# Altium project control_site.PrjPcb
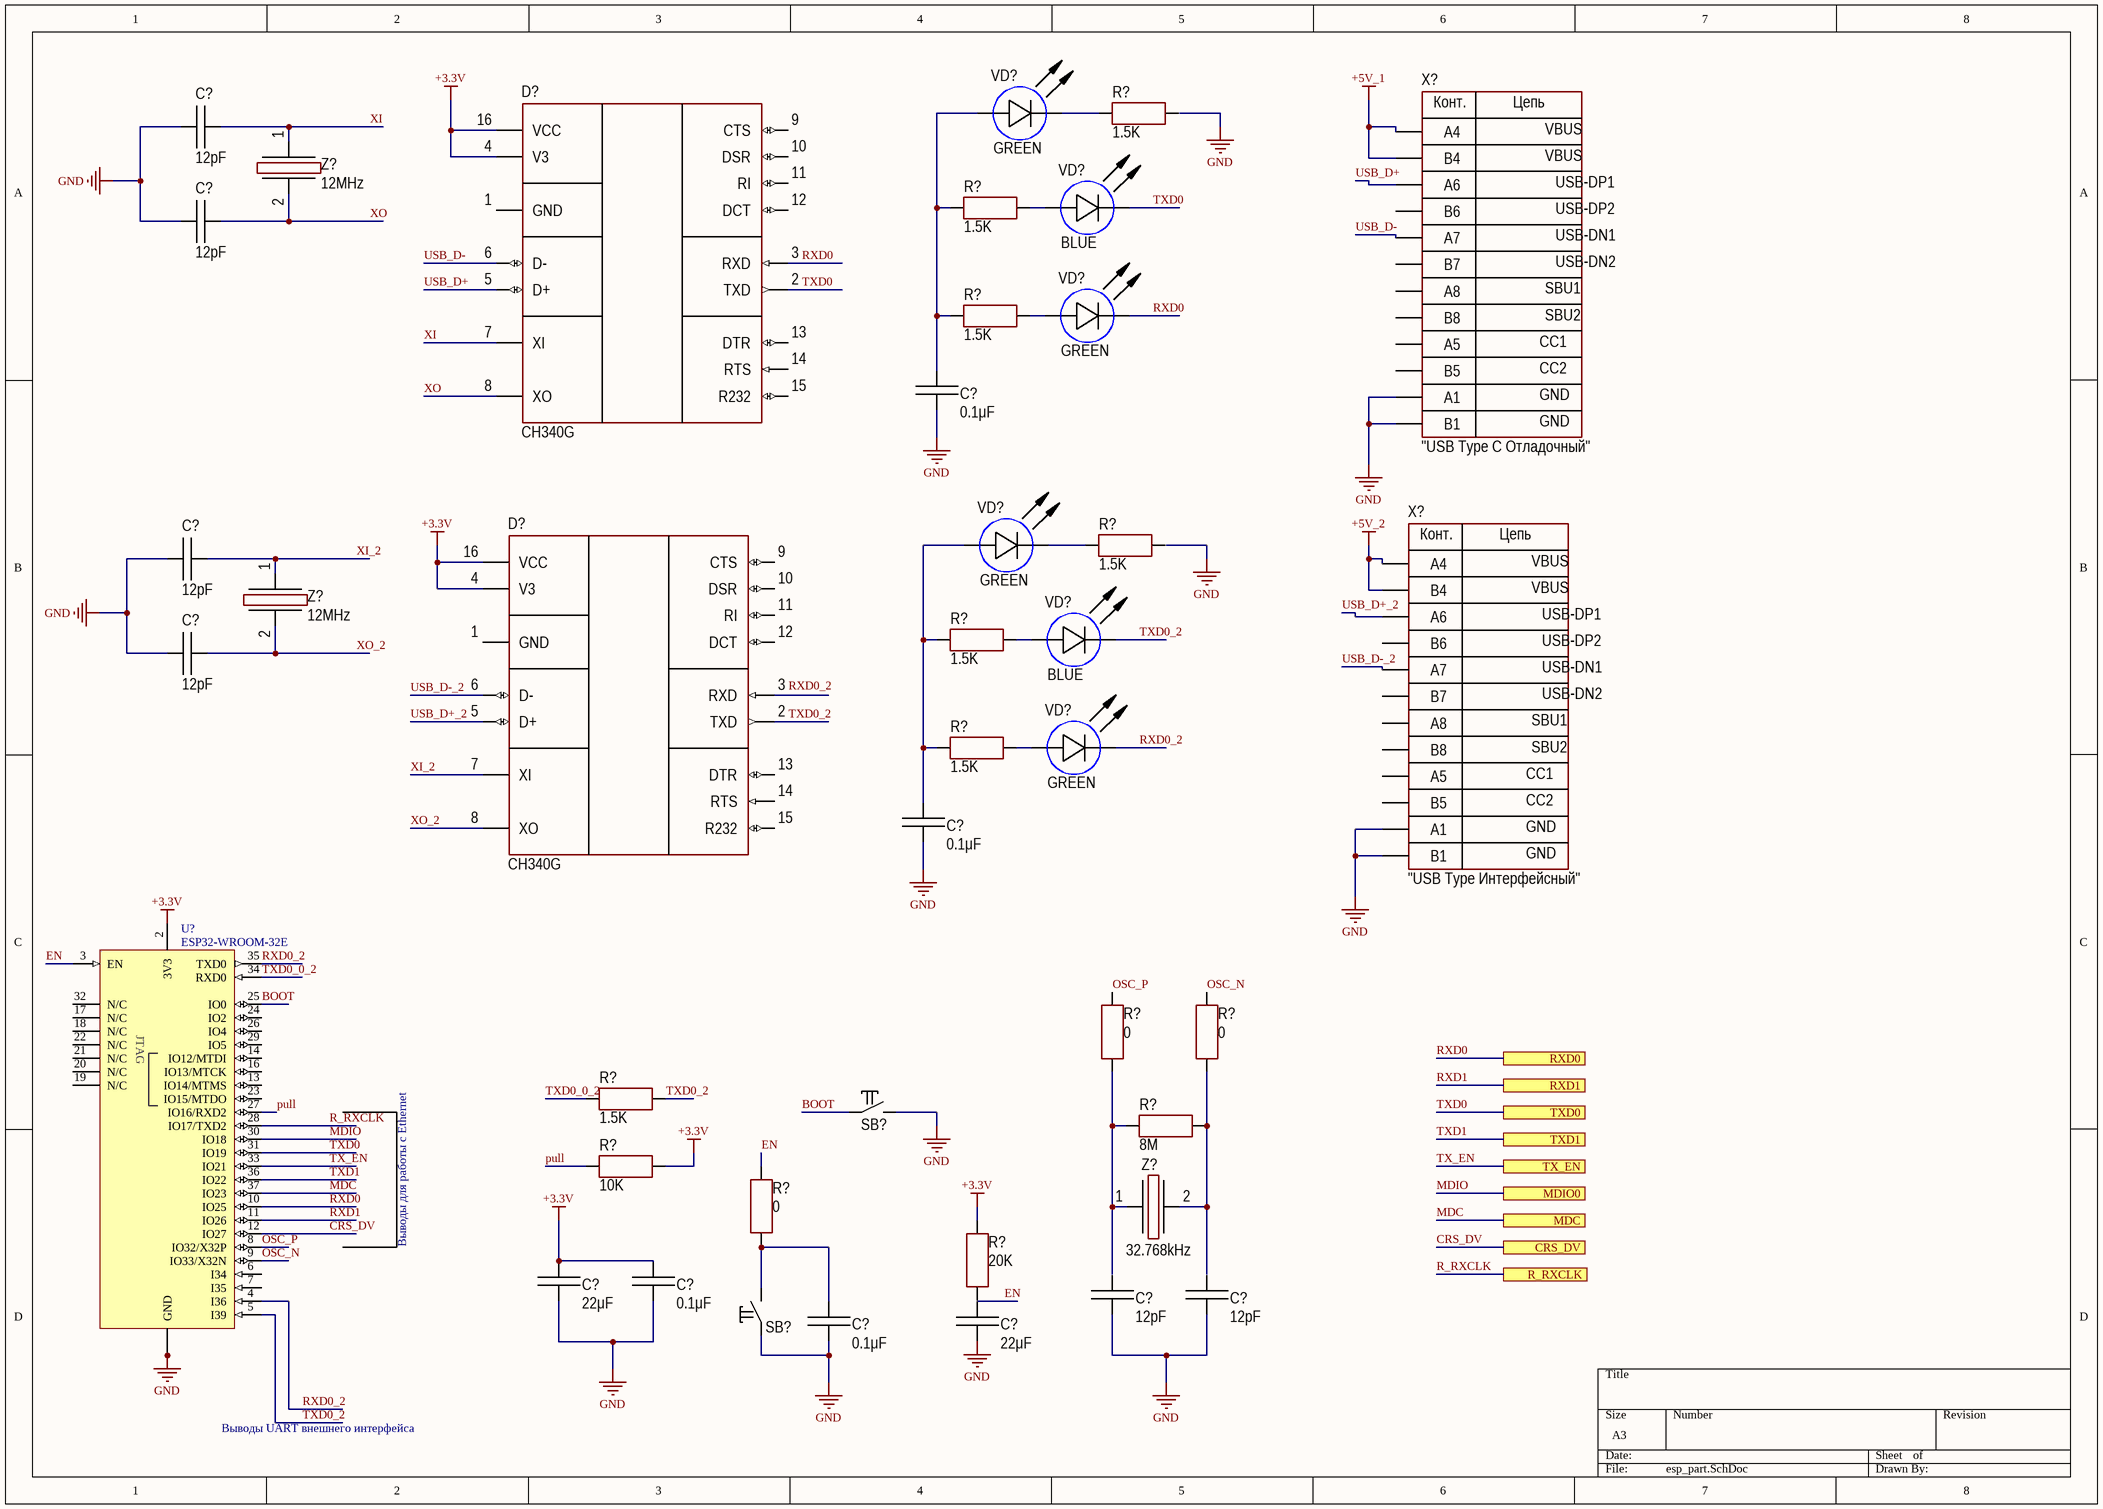
[diagram p0: esp_part.SchDoc]
3 sheets, 102 parts. Net scope: flat (ports and power ports of the same name join across sheets).
Sheets:
  esp_part.SchDoc
  Ethernet_part.SchDoc
  Power_part.SchDoc

## Sheet esp_part.SchDoc
size A3; SheetNumber: 1; SheetTotal: 3; SPICEModelCacheOSMDEVOJ: <root> / <DocumentId>OSMDEVOJ</DocumentId> / </root>

### Parts
(Parts that share a designator on the sheet are numbered #1, #2 ... from top to bottom, then left to right.)
C?#1  value 12pF  [CAP: 0603]
C?#2  value 12pF  [CAP: 0603]
C?#3  value 0.1μF  [CAP: 0603]
C?#4  value 12pF  [CAP: 0603]
C?#5  value 12pF  [CAP: 0603]
C?#6  value 0.1μF  [CAP: 0603]
C?#7  value 22μF  [CAP: 0603]
C?#8  value 0.1μF  [CAP: 0603]
C?#9  value 12pF  [CAP: 0603]
C?#10  value 12pF  [CAP: 0603]
C?#11  value 0.1μF  [CAP: 0603]
C?#12  value 22μF  [CAP: 0603]
D?#1  (no value)  [16-SOP]
D?#2  (no value)  [16-SOP]
R?#1  value 1.5K  [RES: 0603]
R?#2  value 1.5K  [RES: 0603]
R?#3  value 1.5K  [RES: 0603]
R?#4  value 1.5K  [RES: 0603]
R?#5  value 1.5K  [RES: 0603]
R?#6  value 1.5K  [RES: 0603]
R?#7  value 0  [RES: 0603]
R?#8  value 0  [RES: 0603]
R?#9  value 1.5K  [RES: 0603]
R?#10  value 8M  [RES: 0603]
R?#11  value 10K  [RES: 0603]
R?#12  value 0  [RES: 0603]
R?#13  value 20K  [RES: 0603]
SB?#1  (no value)  [BUT: 6x3.5 TH]
SB?#2  (no value)  [BUT: 6x3.5 TH]
U?#1  ESP32-WROOM-32E  [ESP32-WROOM-32E]
VD?#1  Color: GREEN  [LED: 0402B]
VD?#2  Color: BLUE  [LED: 0402B]
VD?#3  Color: GREEN  [LED: 0402B]
VD?#4  Color: GREEN  [LED: 0402B]
VD?#5  Color: BLUE  [LED: 0402B]
VD?#6  Color: GREEN  [LED: 0402B]
X?#1  CommentText: "USB Type C Отладочный"  [CON: TYPE-C-31-M-12]
X?#2  CommentText: "USB Type Интерфейсный"  [CON: TYPE-C-31-M-12]
Z?#1  Frequency: 12MHz  [OSC: 3215]
Z?#2  Frequency: 12MHz  [OSC: 3215]
Z?#3  Frequency: 32.768kHz  [OSC: 3215]

### Ports
CRS_DV (see Ethernet_part[4B]), MDC (see Ethernet_part[4B]), MDIO0 (see Ethernet_part[4A]), R_RXCLK (see Ethernet_part[4B]), RXD0 (see Ethernet_part[4A]), RXD1 (see Ethernet_part[4A]), TX_EN (see Ethernet_part[4A]), TXD0 (see Ethernet_part[4A]), TXD1 (see Ethernet_part[4A])

### Nets
+3.3V: C?#7.2 C?#8.2 D?#1.4(V3) D?#1.16(VCC) D?#2.4(V3) D?#2.16(VCC) R?#11.1 R?#13.2 U?#1.2(3V3)  [project net RXER]
+5V_1: X?#1.A4 X?#1.B4
+5V_2: X?#2.A4 X?#2.B4
GND: C?#1.1 C?#2.1 C?#3.1 C?#4.1 C?#5.1 C?#6.1 C?#7.1 C?#8.1 C?#9.1 C?#10.1 C?#11.2 C?#12.2 SB?#1.2 SB?#2.1 U?#1.1(GND) U?#1.15(GND) U?#1.38(GND) U?#1.39(GND) X?#1.A1 X?#1.B1 X?#2.A1 X?#2.B1
BOOT: SB?#1.1 U?#1.25(IO0)
CRS_DV: U?#1.12(IO27) ; port CRS_DV
EN: C?#12.1 R?#12.2 U?#1.3(EN)
MDC: U?#1.37(IO23) ; port MDC
MDIO: U?#1.30(IO18) ; port MDIO0
OSC_N: R?#8.1 U?#1.9(IO33/X32N)
OSC_P: R?#7.1 U?#1.8(IO32/X32P)
pull: R?#11.2 U?#1.27(IO16/RXD2)
R_RXCLK: U?#1.28(IO17/TXD2) ; port R_RXCLK
RXD0: D?#1.3(RXD) U?#1.10(IO25) VD?#3.2(C) ; port RXD0
RXD0_2: U?#1.4(I36) U?#1.35(TXD0) VD?#6.2(C)
RXD1: U?#1.11(IO26) ; port RXD1
TX_EN: U?#1.33(IO21) ; port TX_EN
TXD0: D?#1.2(TXD) U?#1.31(IO19) VD?#2.2(C) ; port TXD0
TXD0_0_2: R?#9.2 U?#1.34(RXD0)
TXD0_2: D?#2.2(TXD) R?#9.1 U?#1.5(I39) VD?#5.2(C)
TXD1: U?#1.36(IO22) ; port TXD1
USB_D+: D?#1.5(D+) X?#1.A6
USB_D+_2: D?#2.5(D+) X?#2.A6
USB_D-: D?#1.6(D-) X?#1.A7
USB_D-_2: D?#2.6(D-) X?#2.A7
XI: D?#1.7(XI) Z?#1.1
XI_2: D?#2.7(XI) Z?#2.1
XO: D?#1.8(XO) Z?#1.2
XO_2: D?#2.8(XO) Z?#2.2
NetC?#3_2: C?#3.2 R?#2.2 R?#3.2 VD?#1.1(A)
NetC?#6_2: C?#6.2 R?#5.2 R?#6.2 VD?#4.1(A)
NetC?#11_1: C?#11.1 R?#12.1 SB?#2.2
NetR?#1_2: R?#1.2 VD?#1.2(C)
NetR?#2_1: R?#2.1 VD?#2.1(A)
NetR?#3_1: R?#3.1 VD?#3.1(A)
NetR?#4_2: R?#4.2 VD?#4.2(C)
NetR?#5_1: R?#5.1 VD?#5.1(A)
NetR?#6_1: R?#6.1 VD?#6.1(A)
NetR?#7_2: R?#7.2 R?#10.2 Z?#3.1
NetR?#8_2: R?#8.2 R?#10.1 Z?#3.2

Not connected (* = marked no-connect by the designer): C?#1 2; C?#2 2; C?#4 2; C?#5 2; C?#9 2; C?#10 2; D?#1 1(GND) 9(CTS) 10(DSR) 11(RI) 12(DCT) 13(DTR) 14(RTS) 15(R232); D?#2 1(GND) 3(RXD) 9(CTS) 10(DSR) 11(RI) 12(DCT) 13(DTR) 14(RTS) 15(R232); R?#1 1; R?#4 1; R?#13 1; U?#1 6(I34) 7(I35) 13(IO14/MTMS) 14(IO12/MTDI) 16(IO13/MTCK) 17(N/C) 18(N/C) 19(N/C) 20(N/C) 21(N/C) 22(N/C) 23(IO15/MTDO) 24(IO2) 26(IO4) 29(IO5) 32(N/C); X?#1 A5 A8 B5 B6 B7 B8; X?#2 A5 A8 B5 B6 B7 B8

### Notes on the sheet
- Выводы для работы с Ethernet
- Выводы UART внешнего интерфейса
- Labels drawn without touching a wire or pin: RXD0_2
- (in symbol Connector_USB_Type_C) Конт.; Цепь; VBUS; USB-DP1; USB-DP2; USB-DN1; USB-DN2; SBU1; SBU2; CC1; CC2; GND
- (in symbol ESP32-WROOM-32E) JTAG

### Library data of the parts
C?#1 C?#2 C?#4 C?#5 C?#9 C?#10 = Ceramic_0603: Manufacturer: Yageo; PartNumber: CC0603KRX7R7BB104; ValueManufacturerPartNumber: Ceramic capacitor, 12pF, X7R, ±10%, 16V, 0603, -55...+125°C; TypeCapacitor: Ceramic capacitor; Tolerance: ±10%; TypeDielectric: X7R; Voltage: 16V; Package: 0603; HelpURL: https://www.digikey.com/product-detail/en/yageo/CC0603KRX7R7BB104/311-1088-1-ND/302998; Temperature: -55...+125°C
C?#3 C?#6 C?#8 C?#11 = Ceramic_0603: Manufacturer: Yageo; PartNumber: CC0603KRX7R7BB104; ValueManufacturerPartNumber: Ceramic capacitor, 0.1μF, X7R, ±10%, 16V, 0603, -55...+125°C; TypeCapacitor: Ceramic capacitor; Tolerance: ±10%; TypeDielectric: X7R; Voltage: 16V; Package: 0603; HelpURL: https://www.digikey.com/product-detail/en/yageo/CC0603KRX7R7BB104/311-1088-1-ND/302998; Temperature: -55...+125°C
C?#7 C?#12 = Ceramic_0603: Manufacturer: Yageo; PartNumber: CC0603KRX7R7BB104; ValueManufacturerPartNumber: Ceramic capacitor, 22μF, X7R, ±10%, 16V, 0603, -55...+125°C; TypeCapacitor: Ceramic capacitor; Tolerance: ±10%; TypeDielectric: X7R; Voltage: 16V; Package: 0603; HelpURL: https://www.digikey.com/product-detail/en/yageo/CC0603KRX7R7BB104/311-1088-1-ND/302998; Temperature: -55...+125°C
D?#1 D?#2 = CH340G: USB-to-UART; Manufacturer: WCH(Jiangsu Qin Heng); ValueManufacturerPartNumber: IC usb-to-uart bridge, USB2.0, 3...3.6V, -40...+85°C, 16- SOP; Supply: 3...3.6V; HelpURL: https://lcsc.com/product-detail/USB-ICs_WCH-Jiangsu-Qin-Heng-CH340G_C14267.html; Package: 16- SOP; ComponentType: IC usb-to-uart bridge; Temperature: -40...+85°C; Standard: USB2.0; PartNumber: CH340G
R?#1-R?#6 R?#9 = Resistor_0603: Manufacturer: Yageo; PartNumber: RC0603JR-07100RL; ValueManufacturerPartNumber: Resistor film, 1.5K, ±5%, 0603, 0.1W, -55...+125°C; TypeResistor: Resistor film; Power: 0.1W; Tolerance: ±5%; Package: 0603; HelpURL: https://www.digikey.com/product-detail/en/yageo/RC0603JR-07100RL/311-100GRCT-ND/729644; Temperature: -55...+125°C
R?#7 R?#8 R?#12 = Resistor_0603: Manufacturer: Yageo; PartNumber: RC0603JR-07100RL; ValueManufacturerPartNumber: Resistor film, 0, ±5%, 0603, 0.1W, -55...+125°C; TypeResistor: Resistor film; Power: 0.1W; Tolerance: ±5%; Package: 0603; HelpURL: https://www.digikey.com/product-detail/en/yageo/RC0603JR-07100RL/311-100GRCT-ND/729644; Temperature: -55...+125°C
R?#10 = Resistor_0603: Manufacturer: Yageo; PartNumber: RC0603JR-07100RL; ValueManufacturerPartNumber: Resistor film, 8M, ±5%, 0603, 0.1W, -55...+125°C; TypeResistor: Resistor film; Power: 0.1W; Tolerance: ±5%; Package: 0603; HelpURL: https://www.digikey.com/product-detail/en/yageo/RC0603JR-07100RL/311-100GRCT-ND/729644; Temperature: -55...+125°C
R?#11 = Resistor_0603: Manufacturer: Yageo; PartNumber: RC0603JR-07100RL; ValueManufacturerPartNumber: Resistor film, 10K, ±5%, 0603, 0.1W, -55...+125°C; TypeResistor: Resistor film; Power: 0.1W; Tolerance: ±5%; Package: 0603; HelpURL: https://www.digikey.com/product-detail/en/yageo/RC0603JR-07100RL/311-100GRCT-ND/729644; Temperature: -55...+125°C
R?#13 = Resistor_0603: Manufacturer: Yageo; PartNumber: RC0603JR-07100RL; ValueManufacturerPartNumber: Resistor film, 20K, ±5%, 0603, 0.1W, -55...+125°C; TypeResistor: Resistor film; Power: 0.1W; Tolerance: ±5%; Package: 0603; HelpURL: https://www.digikey.com/product-detail/en/yageo/RC0603JR-07100RL/311-100GRCT-ND/729644; Temperature: -55...+125°C
SB?#1 SB?#2 = Button_tactile: Manufacturer: TE Connectivity; ValueManufacturerPartNumber: Tactile button, 6x6mm; PartNumber: FSM2JSMAATR; TypeButton: Tactile button; CommentText: "Кнопка"; HelpURL: https://www.digikey.com/product-detail/en/te-connectivity-alcoswitch-switches/FSM2JSMAATR/450-1792-1-ND/3503931; Package: 6x6mm
U?#1 = ESP32-WROOM-32E: PCB Antenna - 4,8,16 MB Flash - WiFi - BT - MCU; Manufacturer_Name: Espressif Systems; ComponentLink1Description: Datasheet; ComponentLink1URL: https://www.espressif.com/sites/default/files/documentation/esp32-wroom-32e_esp32-wroom-32ue_datasheet_en.pdf; ComponentLink2Description: SoC Datasheet; ComponentLink2URL: https://www.espressif.com/sites/default/files/documentation/esp32_datasheet_en.pdf; ComponentLink3Description: Devkit; ComponentLink3URL: https://www.espressif.com/en/products/devkits/esp32-devkitc
VD?#1 VD?#3 VD?#4 VD?#6 = LED_single: ValueManufacturerPartNumber: LED, Green, *, *, *, -55...+150°C; TypeDiode: LED; Manufacturer: *; Package: *; HelpURL: *; Temperature: -55...+150°C; Current: *; VoltageDrop: *; PartNumber: *; ColorParameter: Green
VD?#2 VD?#5 = LED_single: ValueManufacturerPartNumber: LED, Green, *, *, *, -55...+150°C; TypeDiode: LED; ColorParameter: Green; Manufacturer: *; Package: *; HelpURL: *; Temperature: -55...+150°C; Current: *; VoltageDrop: *; PartNumber: *
X?#1 X?#2 = Connector_USB_Type_C: Manufacturer: Korean Hroparts; ValueManufacturerPartNumber: USB Type C, 3A; PartNumber: TYPE-C-31-M-12; TypeConnector: USB Type C; CurrentMax: 3A; HelpURL: https://lcsc.com/product-detail/USB-Type-C_Korean-Hroparts-Elec-TYPE-C-31-M-12_C165948.html
Z?#1 Z?#2 = Crystal_3215: Manufacturer: Epson; PartNumber: FC-135 32.7680KA-A5; ValueManufacturerPartNumber: Crystal, 12MHz, 12.5pF, ±20ppm, case 3215, -40...+85°C; LoadCapacitance: 12.5pF; Tolerance: ±20ppm; Package: case 3215; HelpURL: https://www.digikey.com/product-detail/en/epson/FC-135-32.7680KA-A5/SER4103CT-ND/6188447; Temperature: -40...+85°C; TypeOscilator: Crystal
Z?#3 = Crystal_3215: Manufacturer: Epson; PartNumber: FC-135 32.7680KA-A5; ValueManufacturerPartNumber: Crystal, 32.768kHz, 12.5pF, ±20ppm, case 3215, -40...+85°C; LoadCapacitance: 12.5pF; Tolerance: ±20ppm; Package: case 3215; HelpURL: https://www.digikey.com/product-detail/en/epson/FC-135-32.7680KA-A5/SER4103CT-ND/6188447; Temperature: -40...+85°C; TypeOscilator: Crystal

## Sheet Ethernet_part.SchDoc
size A4; SheetNumber: 2; SheetTotal: 3
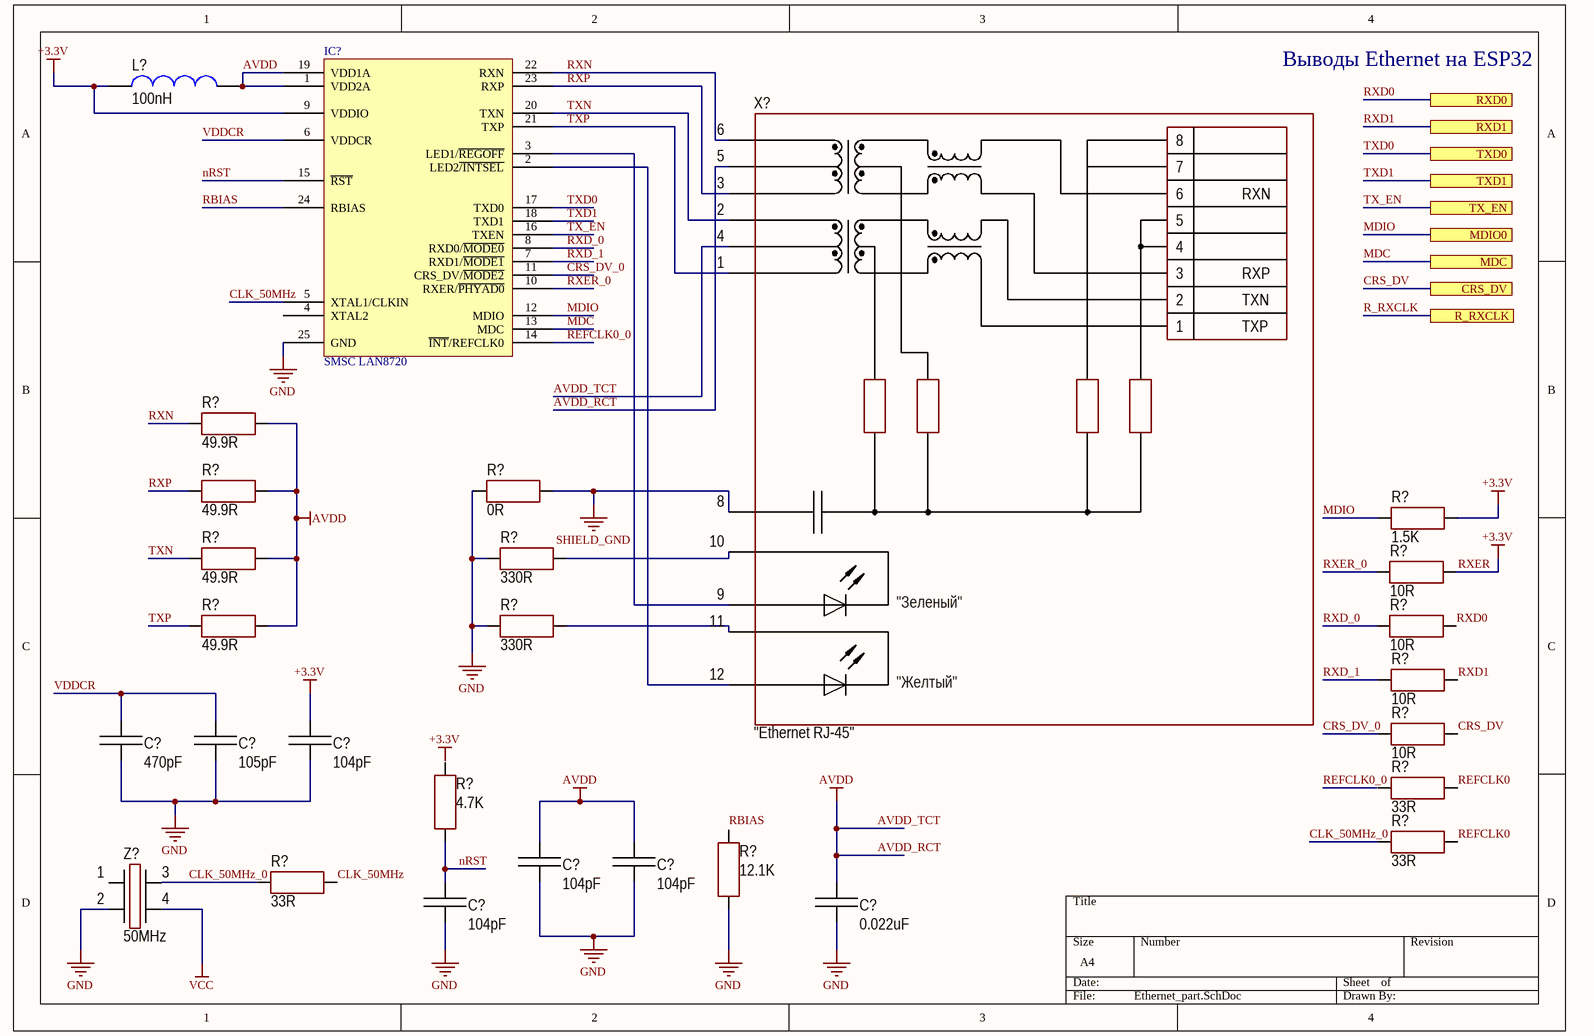
[diagram p1: Ethernet_part.SchDoc]

### Parts
(Parts that share a designator on the sheet are numbered #1, #2 ... from top to bottom, then left to right.)
C?#13  value 470pF  [CAP: 0402]
C?#14  value 105pF  [CAP: 0402]
C?#15  value 104pF  [CAP: 0402]
C?#16  value 104pF  [CAP: 0402]
C?#17  value 104pF  [CAP: 0402]
C?#18  value 104pF  [CAP: 0402]
C?#19  value 0.022uF  [CAP: 0402]
IC?  SMSC LAN8720  [MICROCHIP QFN-24 4x4]
L?  value 100nH  [IND: 0402]
R?#14  value 49.9R  [RES: 0402]
R?#15  value 49.9R  [RES: 0402]
R?#16  value 0R  [RES: 0402]
R?#17  value 1.5K  [RES: 0402]
R?#18  value 49.9R  [RES: 0402]
R?#19  value 330R  [RES: 0402]
R?#20  value 10R  [RES: 0402]
R?#21  value 49.9R  [RES: 0402]
R?#22  value 330R  [RES: 0402]
R?#23  value 10R  [RES: 0402]
R?#24  value 10R  [RES: 0402]
R?#25  value 10R  [RES: 0402]
R?#26  value 4.7K  [RES: 0402]
R?#27  value 33R  [RES: 0402]
R?#28  value 12.1K  [RES: 0402]
R?#29  value 33R  [RES: 0402]
R?#30  value 33R  [RES: 0402]
X?#3  CommentText: "Ethernet RJ-45"  [CON: HR911105A]
Z?#4  Frequency: 50MHz  [OSC: 3225]

### Ports
CRS_DV (see esp_part[6D]), MDC (see esp_part[6D]), MDIO0 (see esp_part[6D]), R_RXCLK (see esp_part[6D]), RXD0 (see esp_part[6C]), RXD1 (see esp_part[6C]), TX_EN (see esp_part[6D]), TXD0 (see esp_part[6C]), TXD1 (see esp_part[6D])

### Nets
AVDD: C?#16.2 C?#17.2 C?#19.2 IC?.1(VDD2A) IC?.19(VDD1A) L?.1 R?#14.1 R?#15.1 R?#18.1 R?#21.1 X?#3.4(CT) X?#3.5(CT)  [also labelled AVDD_RCT, AVDD_TCT]
GND: C?#15.1 C?#17.1 C?#19.1 IC?.25(GND) R?#16.1 R?#19.1 R?#22.1 R?#28.2 Z?#4.2
RXER: C?#15.2 IC?.9(VDDIO) L?.2 R?#17.1 R?#20.1  [also labelled +3.3V]
SHIELD_GND: R?#16.2 X?#3.8(GND)
VCC: Z?#4.4
CLK_50MHz: IC?.5(XTAL1/CLKIN) R?#30.2
CLK_50MHz_0: R?#29.2 R?#30.1 Z?#4.3
CRS_DV: R?#25.1 ; port CRS_DV
CRS_DV_0: IC?.11(CRS_DV/~{MODE2}) R?#25.2
MDC: IC?.13(MDC) ; port MDC
MDIO: IC?.12(MDIO) R?#17.2 ; port MDIO0
nRST: C?#18.2 IC?.15(~{RST}) R?#26.2
RBIAS: IC?.24(RBIAS)
REFCLK0: R?#27.1 R?#29.1
REFCLK0_0: IC?.14(~{INT}/REFCLK0)
RXD0: R?#23.1 ; port RXD0
RXD1: R?#24.1 ; port RXD1
RXD_0: IC?.8(RXD0/~{MODE0}) R?#23.2
RXD_1: IC?.7(RXD1/~{MODE1}) R?#24.2
RXER_0: IC?.10(RXER/~{PHYAD0}) R?#20.2
RXN: IC?.22(RXN) R?#14.2 X?#3.6(RD-)
RXP: IC?.23(RXP) R?#15.2 X?#3.3(RD+)
TX_EN: IC?.16(TXEN) ; port TX_EN
TXD0: IC?.17(TXD0) ; port TXD0
TXD1: IC?.18(TXD1) ; port TXD1
TXN: IC?.20(TXN) R?#18.2 X?#3.2(TD-)
TXP: IC?.21(TXP) R?#21.2 X?#3.1(TD+)
VDDCR: C?#13.2 C?#14.2 IC?.6(VDDCR)
NetIC?_2: IC?.2(LED2~{/INTSEL}) X?#3.12(D4)
NetIC?_3: IC?.3(LED1/~{REGOFF}) X?#3.9(D2)
NetR?#19_2: R?#19.2 X?#3.10(D1)
NetR?#22_2: R?#22.2 X?#3.11(D3)

Not connected (* = marked no-connect by the designer): C?#13 1; C?#14 1; C?#16 1; C?#18 1; IC? 4(XTAL2); R?#26 1; R?#27 2; R?#28 1; Z?#4 1

### Notes on the sheet
- Выводы Ethernet на ESP32
- Labels drawn without touching a wire or pin: +3.3V, RBIAS
- (in symbol Connector_HR911105A) 7; RXN; RXP; TXN; TXP; "Зеленый"; "Желтый"

### Library data of the parts
C?#13 = Ceramic_0402: Manufacturer: Yageo; PartNumber: CC0402KRX7R7BB104; ValueManufacturerPartNumber: Ceramic capacitor, 470pF, X7R, ±10%, 16V, 0402, -55...+125°C; TypeCapacitor: Ceramic capacitor; Tolerance: ±10%; TypeDielectric: X7R; Voltage: 16V; Package: 0402; HelpURL: https://www.digikey.com/product-detail/en/yageo/CC0402KRX7R7BB104/311-1338-1-ND/2103122; Temperature: -55...+125°C
C?#14 = Ceramic_0402: Manufacturer: Yageo; PartNumber: CC0402KRX7R7BB104; ValueManufacturerPartNumber: Ceramic capacitor, 105pF, X7R, ±10%, 16V, 0402, -55...+125°C; TypeCapacitor: Ceramic capacitor; Tolerance: ±10%; TypeDielectric: X7R; Voltage: 16V; Package: 0402; HelpURL: https://www.digikey.com/product-detail/en/yageo/CC0402KRX7R7BB104/311-1338-1-ND/2103122; Temperature: -55...+125°C
C?#15-C?#18 = Ceramic_0402: Manufacturer: Yageo; PartNumber: CC0402KRX7R7BB104; ValueManufacturerPartNumber: Ceramic capacitor, 104pF, X7R, ±10%, 16V, 0402, -55...+125°C; TypeCapacitor: Ceramic capacitor; Tolerance: ±10%; TypeDielectric: X7R; Voltage: 16V; Package: 0402; HelpURL: https://www.digikey.com/product-detail/en/yageo/CC0402KRX7R7BB104/311-1338-1-ND/2103122; Temperature: -55...+125°C
C?#19 = Ceramic_0402: Manufacturer: Yageo; PartNumber: CC0402KRX7R7BB104; ValueManufacturerPartNumber: Ceramic capacitor, 0.022uF, X7R, ±10%, 16V, 0402, -55...+125°C; TypeCapacitor: Ceramic capacitor; Tolerance: ±10%; TypeDielectric: X7R; Voltage: 16V; Package: 0402; HelpURL: https://www.digikey.com/product-detail/en/yageo/CC0402KRX7R7BB104/311-1338-1-ND/2103122; Temperature: -55...+125°C
IC? = SMSC LAN8720: Small Footprint RMII 10/100 Ethernet  Transceiver with HP Auto-MDIX Support
L? = Inductor_0402: Manufacturer: Murata Electronics; PartNumber: LQG15HSR10J02D; ValueManufacturerPartNumber: Fixed inductor, 100nH, ±5%, 0402, 200mA, -55...+125°C; TypeInductor: Fixed inductor; MaxCurrent: 200mA; Tolerance: ±5%; Package: 0402; HelpURL: https://www.digikey.com/product-detail/en/murata-electronics-north-america/LQG15HSR10J02D/490-2635-1-ND/662915; Temperature: -55...+125°C
R?#14 R?#15 R?#18 R?#21 = Resistor_0402: Manufacturer: Yageo; PartNumber: RC0402JR-07100RL; ValueManufacturerPartNumber: Resistor film, 49.9R, ±5%, 0402, 0.063W, -55...+125°C; TypeResistor: Resistor film; Power: 0.063W; Tolerance: ±5%; Package: 0402; HelpURL: https://www.digikey.com/product-detail/en/yageo/RC0402JR-07100RL/311-100JRCT-ND/729362; Temperature: -55...+125°C
R?#16 = Resistor_0402: Manufacturer: Yageo; PartNumber: RC0402JR-07100RL; ValueManufacturerPartNumber: Resistor film, 0R, ±5%, 0402, 0.063W, -55...+125°C; TypeResistor: Resistor film; Power: 0.063W; Tolerance: ±5%; Package: 0402; HelpURL: https://www.digikey.com/product-detail/en/yageo/RC0402JR-07100RL/311-100JRCT-ND/729362; Temperature: -55...+125°C
R?#17 = Resistor_0402: Manufacturer: Yageo; PartNumber: RC0402JR-07100RL; ValueManufacturerPartNumber: Resistor film, 1.5K, ±5%, 0402, 0.063W, -55...+125°C; TypeResistor: Resistor film; Power: 0.063W; Tolerance: ±5%; Package: 0402; HelpURL: https://www.digikey.com/product-detail/en/yageo/RC0402JR-07100RL/311-100JRCT-ND/729362; Temperature: -55...+125°C
R?#19 R?#22 = Resistor_0402: Manufacturer: Yageo; PartNumber: RC0402JR-07100RL; ValueManufacturerPartNumber: Resistor film, 330R, ±5%, 0402, 0.063W, -55...+125°C; TypeResistor: Resistor film; Power: 0.063W; Tolerance: ±5%; Package: 0402; HelpURL: https://www.digikey.com/product-detail/en/yageo/RC0402JR-07100RL/311-100JRCT-ND/729362; Temperature: -55...+125°C
R?#20 R?#23-R?#25 = Resistor_0402: Manufacturer: Yageo; PartNumber: RC0402JR-07100RL; ValueManufacturerPartNumber: Resistor film, 10R, ±5%, 0402, 0.063W, -55...+125°C; TypeResistor: Resistor film; Power: 0.063W; Tolerance: ±5%; Package: 0402; HelpURL: https://www.digikey.com/product-detail/en/yageo/RC0402JR-07100RL/311-100JRCT-ND/729362; Temperature: -55...+125°C
R?#26 = Resistor_0402: Manufacturer: Yageo; PartNumber: RC0402JR-07100RL; ValueManufacturerPartNumber: Resistor film, 4.7K, ±5%, 0402, 0.063W, -55...+125°C; TypeResistor: Resistor film; Power: 0.063W; Tolerance: ±5%; Package: 0402; HelpURL: https://www.digikey.com/product-detail/en/yageo/RC0402JR-07100RL/311-100JRCT-ND/729362; Temperature: -55...+125°C
R?#27 R?#29 R?#30 = Resistor_0402: Manufacturer: Yageo; PartNumber: RC0402JR-07100RL; ValueManufacturerPartNumber: Resistor film, 33R, ±5%, 0402, 0.063W, -55...+125°C; TypeResistor: Resistor film; Power: 0.063W; Tolerance: ±5%; Package: 0402; HelpURL: https://www.digikey.com/product-detail/en/yageo/RC0402JR-07100RL/311-100JRCT-ND/729362; Temperature: -55...+125°C
R?#28 = Resistor_0402: Manufacturer: Yageo; PartNumber: RC0402JR-07100RL; ValueManufacturerPartNumber: Resistor film, 12.1K, ±5%, 0402, 0.063W, -55...+125°C; TypeResistor: Resistor film; Power: 0.063W; Tolerance: ±5%; Package: 0402; HelpURL: https://www.digikey.com/product-detail/en/yageo/RC0402JR-07100RL/311-100JRCT-ND/729362; Temperature: -55...+125°C
X?#3 = Connector_HR911105A: Manufacturer: Hanrun; ValueManufacturerPartNumber: Etherner RJ-45 connector; HelpURL: https://ru.aliexpress.com/item/32244614847.html?spm=a2g0v.search0104.3.9.304d24e7qb4B5g&ws_ab_test=searchweb0_0%2Csearchweb201602_10_10065_10068_319_317_10696_453_10084_454_10083_10618_10307_10301_537_536_10059_10884_10887_321_322_10915_10103_10914_10911_10910%2Csearchweb201603_52%2CppcSwitch_0&algo_expid=ad591376-da58-472d-83c6-21bacd43ef2b-1&algo_pvid=ad591376-da58-472d-83c6-21bacd43ef2b&transAbTest=ae803_5; TypeConnector: Etherner RJ-45 connector; PartNumber: HR911105A
Z?#4 = Crystal_3225: Manufacturer: Diodes Incorporated; PartNumber: FL1000002; ValueManufacturerPartNumber: Crystal, 50MHz, 12pF, ±25ppm, case 3225, -40...+85°C; LoadCapacitance: 12pF; Tolerance: ±25ppm; Package: case 3225; HelpURL: https://www.digikey.com/product-detail/en/diodes-incorporated/FL1000002/FL1000002CT-ND/6042078; Temperature: -40...+85°C; TypeOscilator: Crystal

## Sheet Power_part.SchDoc
size A4; SheetNumber: 3; SheetTotal: 3
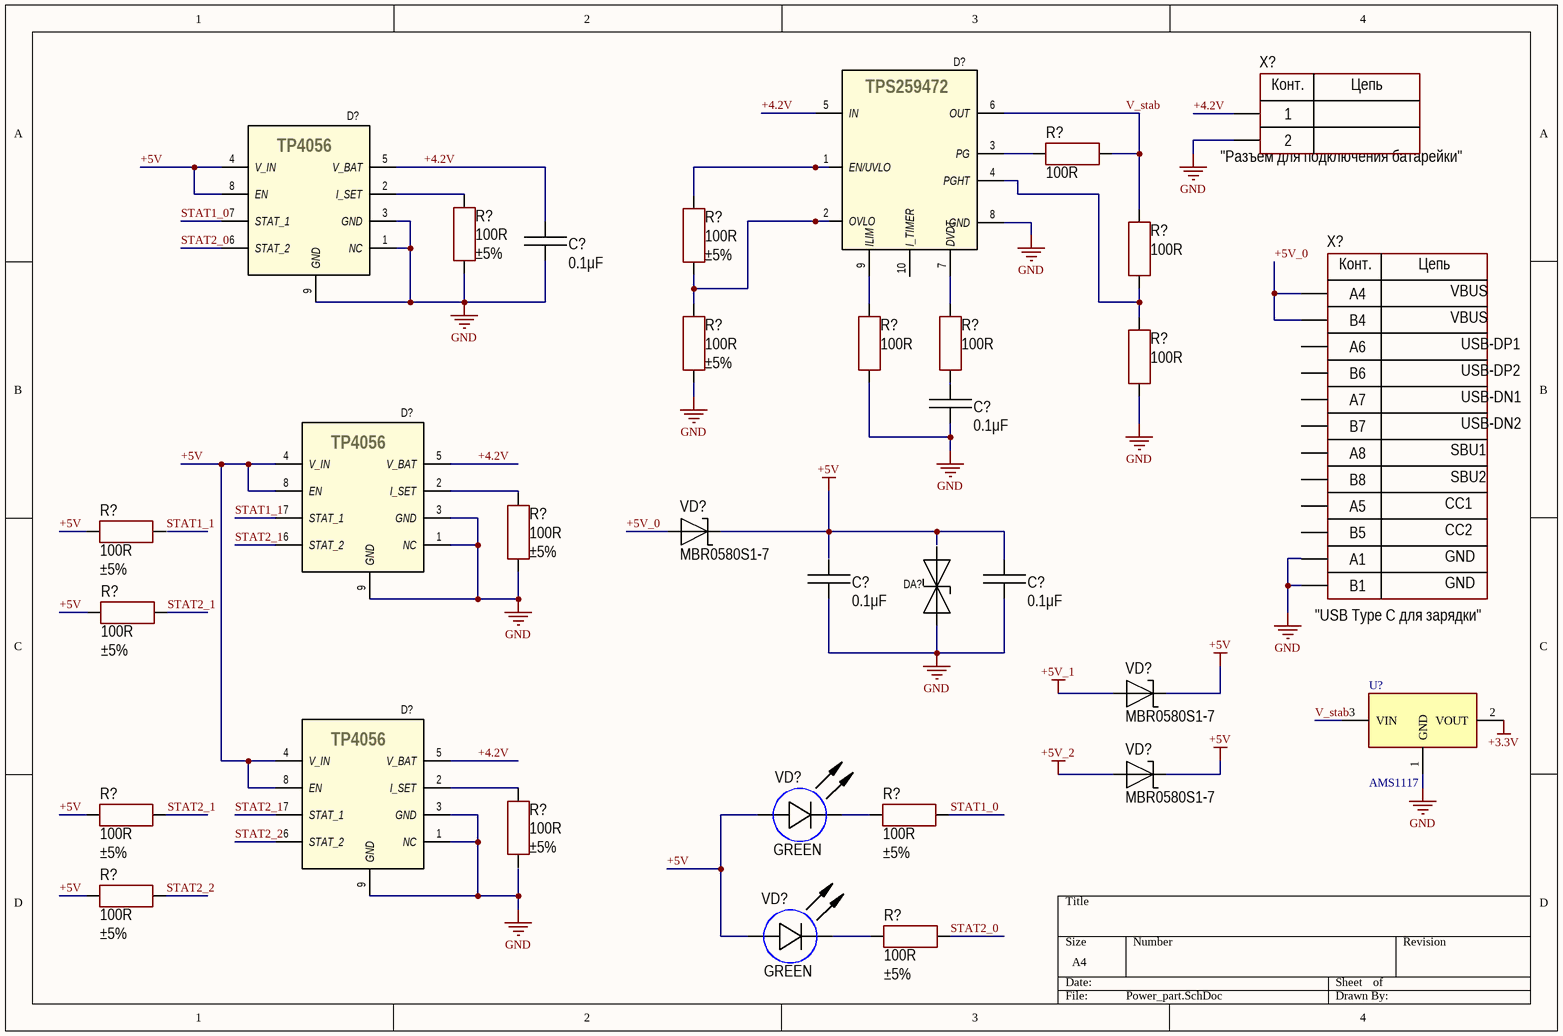
[diagram p2: Power_part.SchDoc]

### Parts
(Parts that share a designator on the sheet are numbered #1, #2 ... from top to bottom, then left to right.)
C?#20  value 0.1μF  [CAP: 0603]
C?#21  value 0.1μF  [CAP: 0603]
C?#22  value 0.1μF  [CAP: 0603]
C?#23  value 0.1μF  [CAP: 0603]
D?#3  Texas Instruments  [TPS259472ARPWR]  (value not drawn)
D?#4  UTD Semiconductor Co.,Ltd  [TP4056]  (value not drawn)
D?#5  UTD Semiconductor Co.,Ltd  [TP4056]  (value not drawn)
D?#6  UTD Semiconductor Co.,Ltd  [TP4056]  (value not drawn)
DA?  Littelfuse  [SMAJ12CA]  (value not drawn)
R?#31  value 100R  [RES: 0603]
R?#32  value 100R  Tolerance: ±5%  [RES: 0603]
R?#33  value 100R  Tolerance: ±5%  [RES: 0603]
R?#34  value 100R  [RES: 0603]
R?#35  value 100R  Tolerance: ±5%  [RES: 0603]
R?#36  value 100R  [RES: 0603]
R?#37  value 100R  [RES: 0603]
R?#38  value 100R  [RES: 0603]
R?#39  value 100R  Tolerance: ±5%  [RES: 0603]
R?#40  value 100R  Tolerance: ±5%  [RES: 0603]
R?#41  value 100R  Tolerance: ±5%  [RES: 0603]
R?#42  value 100R  Tolerance: ±5%  [RES: 0603]
R?#43  value 100R  Tolerance: ±5%  [RES: 0603]
R?#44  value 100R  Tolerance: ±5%  [RES: 0603]
R?#45  value 100R  Tolerance: ±5%  [RES: 0603]
R?#46  value 100R  Tolerance: ±5%  [RES: 0603]
U?#2  AMS1117  [AMS1117]
VD?#7  PartNumber: MBR0580S1-7  [DIODE: SMA]
VD?#8  PartNumber: MBR0580S1-7  [DIODE: SMA]
VD?#9  PartNumber: MBR0580S1-7  [DIODE: SMA]
VD?#10  Color: GREEN  [LED: 0402B]
VD?#11  Color: GREEN  [LED: 0402B]
X?#4  CommentText: "Разъем для подключения батарейки"  [CON: PLS-2]
X?#5  CommentText: "USB Type C для зарядки"  [CON: TYPE-C-31-M-12]

### Nets
+3.3V: U?#2.2(VOUT)  [project net RXER]
+5V: C?#23.2 D?#4.4(V_IN) D?#4.8(EN) D?#5.4(V_IN) D?#5.8(EN) D?#6.4(V_IN) D?#6.8(EN) R?#39.1 R?#41.1 R?#42.1 R?#45.2 VD?#7.2 VD?#8.2 VD?#9.2 VD?#10.1(A) VD?#11.1(A)
+5V_1: VD?#8.1
+5V_2: VD?#9.1
GND: C?#20.2 C?#21.1 C?#22.1 C?#23.1 D?#3.8(GND) D?#4.1(NC) D?#4.3(GND) D?#4.9(GND) D?#5.1(NC) D?#5.3(GND) D?#5.9(GND) D?#6.1(NC) D?#6.3(GND) D?#6.9(GND) DA?.2 R?#32.1 R?#35.1 R?#36.1 R?#38.1 R?#40.1 U?#2.1(GND) X?#4.2 X?#5.A1 X?#5.B1
+4.2V: C?#20.1 D?#3.5(IN) D?#4.5(V_BAT) D?#5.5(V_BAT) D?#6.5(V_BAT) X?#4.1
+5V_0: VD?#7.1 X?#5.A4 X?#5.B4
STAT1_0: D?#4.7(STAT_1) R?#43.2
STAT1_1: D?#5.7(STAT_1) R?#39.2
STAT2_0: D?#4.6(STAT_2) R?#46.2
STAT2_1: D?#5.6(STAT_2) D?#6.7(STAT_1) R?#41.2 R?#42.2
STAT2_2: D?#6.6(STAT_2) R?#45.1
V_stab: D?#3.6(OUT) R?#31.1 R?#34.2 U?#2.3(VIN)
NetC?#21_2: C?#21.2 R?#37.1
NetD?#3_1: D?#3.1(EN/UVLO) R?#33.2
NetD?#3_2: D?#3.2(OVLO) R?#33.1 R?#35.2
NetD?#3_3: D?#3.3(PG) R?#31.2
NetD?#3_4: D?#3.4(PGHT) R?#34.1 R?#38.2
NetD?#3_7: D?#3.7(DVDT) R?#37.2
NetD?#3_9: D?#3.9(ILIM) R?#36.2
NetD?#4_2: D?#4.2(I_SET) R?#32.2
NetD?#5_2: D?#5.2(I_SET) R?#40.2
NetD?#6_2: D?#6.2(I_SET) R?#44.2
NetR?#43_1: R?#43.1 VD?#10.2(C)
NetR?#46_1: R?#46.1 VD?#11.2(C)

Not connected (* = marked no-connect by the designer): C?#22 2; D?#3 10(I_TIMER); DA? 1; R?#44 1; X?#5 A5 A6 A7 A8 B5 B6 B7 B8

### Notes on the sheet
- (in symbol Connector_USB_Type_C) Конт.; Цепь; VBUS; USB-DP1; USB-DP2; USB-DN1; USB-DN2; SBU1; SBU2; CC1; CC2; GND
- (in symbol PLS-2) Конт.; Цепь
- (in symbol TPS259472ARPWR) TPS259472

### Library data of the parts
C?#20-C?#23 = Ceramic_0603: as C?#3 on sheet esp_part; Package: 0603; HelpURL: https://www.digikey.com/product-detail/en/yageo/CC0603KRX7R7BB104/311-1088-1-ND/302998; Temperature: -55...+125°C
D?#3 = TPS259472ARPWR: Hot Swap Voltage Controllers 2.7-V to 23-V 28-mOhm 5.5-A eFuse
D?#4-D?#6 = TP4056: Контроллер заряда Li-Ion аккумуляторов, 1А
DA? = SMAJ12CA: ESD Protection Diodes / TVS Diodes 12V 5uA 20.1 Amps Bi-Directional
R?#31 R?#34 R?#36-R?#38 = Resistor_0603: Manufacturer: Yageo; PartNumber: RC0603JR-07100RL; ValueManufacturerPartNumber: Resistor film, 100R, ±5%, 0603, 0.1W, -55...+125°C; TypeResistor: Resistor film; Power: 0.1W; Tolerance: ±5%; Package: 0603; HelpURL: https://www.digikey.com/product-detail/en/yageo/RC0603JR-07100RL/311-100GRCT-ND/729644; Temperature: -55...+125°C
R?#32 R?#33 R?#35 R?#39-R?#46 = Resistor_0603: Manufacturer: Yageo; PartNumber: RC0603JR-07100RL; ValueManufacturerPartNumber: Resistor film, 100R, ±5%, 0603, 0.1W, -55...+125°C; TypeResistor: Resistor film; Power: 0.1W; Package: 0603; HelpURL: https://www.digikey.com/product-detail/en/yageo/RC0603JR-07100RL/311-100GRCT-ND/729644; Temperature: -55...+125°C
U?#2 = AMS1117: IC REG LINEAR 1A SOT-89-3L; ComponentLink1Description: Datasheet; ComponentLink1URL: http://www.advanced-monolithic.com/pdf/ds1117.pdf; Digikey PN: 4518-AMS1117-3.3CT-ND; JLCPCB PN: C963410
VD?#7-VD?#9 = Schottky_single: Manufacturer: Diodes Incorporated; ValueManufacturerPartNumber: Schottky diode, 80V, 500mA, 1V, 15pF, SOD-123, -55...+150°C; TypeDiode: Schottky diode; Voltage: 80V; Current: 500mA; VoltageDrop: 1V; RecoveryTime: 15pF; Package: SOD-123; HelpURL: https://www.digikey.com/product-detail/en/diodes-incorporated/MBR0580S1-7/MBR0580S1-7DICT-ND/5080371; Temperature: -55...+150°C
VD?#10 VD?#11 = LED_single: as VD?#1 on sheet esp_part; Manufacturer: *; Package: *; HelpURL: *; Temperature: -55...+150°C; Current: *; VoltageDrop: *; PartNumber: *; ColorParameter: Green
X?#4 = PLS-2: Manufacturer: Connfly; ValueManufacturerPartNumber: Connector, 2pin, 2.54mm, 500VAC, 3A; TypeConnector: Connector; VoltageMax: 500VAC; Pitch: 2.54mm; CurrentMax: 3A; Multichannel: 2pin; HelpURL: https://www.chipdip.ru/product/pls-2; PartNumber: PLS-2
X?#5 = Connector_USB_Type_C: as X?#1 on sheet esp_part; HelpURL: https://lcsc.com/product-detail/USB-Type-C_Korean-Hroparts-Elec-TYPE-C-31-M-12_C165948.html

## Nets that join several sheets
+5V_1: esp_part (X?#1.A4 X?#1.B4), Power_part (VD?#8.1)
+5V_2: esp_part (X?#2.A4 X?#2.B4), Power_part (VD?#9.1)
GND: esp_part (22 pins), Ethernet_part (9 pins), Power_part (24 pins)
RXER: esp_part (9 pins), Ethernet_part (5 pins), Power_part (U?#2.2)
CRS_DV: esp_part (U?#1.12), Ethernet_part (R?#25.1)
MDC: esp_part (U?#1.37), Ethernet_part (IC?.13)
MDIO: esp_part (U?#1.30), Ethernet_part (IC?.12 R?#17.2)
RXD0: esp_part (D?#1.3 U?#1.10 VD?#3.2), Ethernet_part (R?#23.1)
RXD1: esp_part (U?#1.11), Ethernet_part (R?#24.1)
TX_EN: esp_part (U?#1.33), Ethernet_part (IC?.16)
TXD0: esp_part (D?#1.2 U?#1.31 VD?#2.2), Ethernet_part (IC?.17)
TXD1: esp_part (U?#1.36), Ethernet_part (IC?.18)